# Altium project STM32_base.PrjPcb
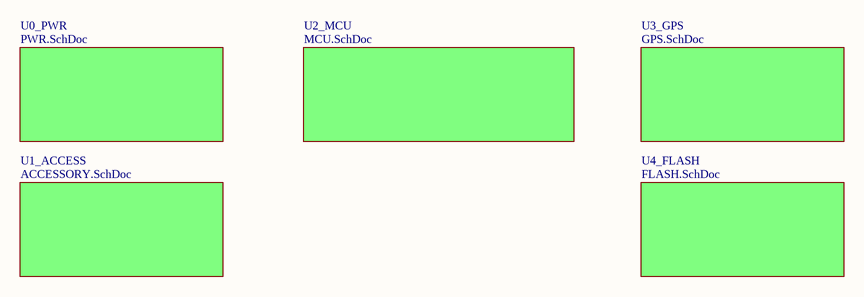
[diagram p0: BLOCK.SchDoc]
6 sheets, 52 parts. Net scope: flat (ports and power ports of the same name join across sheets).
Board file: STM32_base.PcbDoc
Sheets:
  BLOCK.SchDoc
    U2_MCU = MCU.SchDoc
    U0_PWR = PWR.SchDoc
    U3_GPS = GPS.SchDoc
    U1_ACCESS = ACCESSORY.SchDoc
    U4_FLASH = FLASH.SchDoc

## Sheet BLOCK.SchDoc
size A4; Organization: Altium Limited; Address1: L3, 12a Rodborough Rd; Address2: Frenchs Forest; Address3: NSW; Address4: Australia 2086

### Sub-sheets
U0_PWR = PWR.SchDoc: no entries
U1_ACCESS = ACCESSORY.SchDoc: no entries
U2_MCU = MCU.SchDoc: no entries
U3_GPS = GPS.SchDoc: no entries
U4_FLASH = FLASH.SchDoc: no entries

### Notes on the sheet
- Title
- Size:
- Date:
- A4
- Number:
- Time:
- Revision:
- Sheet
- of
- File:

## Sheet MCU.SchDoc
size A4; Organization: Altium Limited; Address1: L3, 12a Rodborough Rd; Address2: Frenchs Forest; Address3: NSW; Address4: Australia 2086
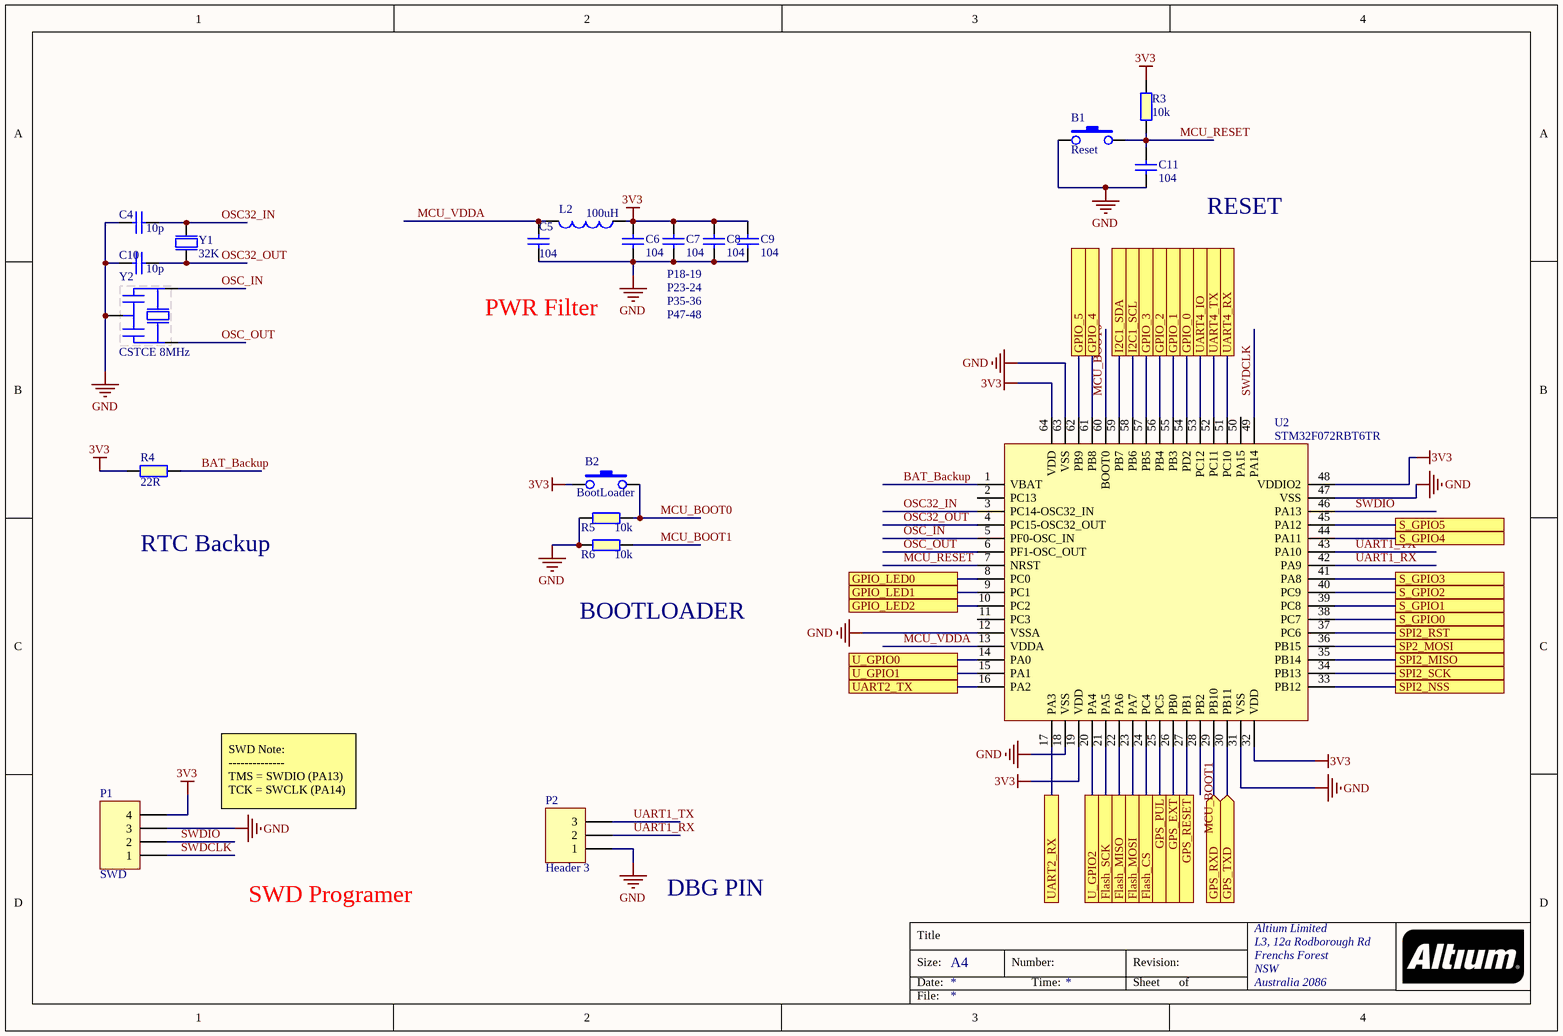
[diagram p1: MCU.SchDoc]

### Parts
B1  Reset  [TACTILE-SWITCH-1101NE]
B2  BootLoader  [TACTILE-SWITCH-1101NE]
C4  10p  [C_0603]
C5  104  [C_0603]
C6  104  [C_0603]
C7  104  [C_0603]
C8  104  [C_0603]
C9  104  [C_0603]
C10  10p  [C_0603]
C11  104  [C_0603]
L2  100uH  [INDUCTOR_0603]
P1  SWD  [HDR1X4]
P2  Header 3  [HDR1X3]
R3  10k  [R_0603]
R4  22R  [R_0603]
R5  10k  [R_0603]
R6  10k  [R_0603]
U2  STM32F072RBT6TR  [STM32L072RBT]
Y1  value 32K  [Crystal_2P]  (hidden comment: Crystal_2P)
Y2  CSTCE 8MHz  [Crystal_4P]

### Ports
Flash_CS, Flash_MISO, Flash_MOSI, Flash_SCK, GPIO_0, GPIO_1, GPIO_2, GPIO_3, GPIO_4, GPIO_5, GPIO_LED0, GPIO_LED1, GPIO_LED2, GPS_EXT, GPS_PUL, GPS_RESET, GPS_RXD (in), GPS_TXD (in), I2C1_SCL, I2C1_SDA, S_GPIO0, S_GPIO1, S_GPIO2, S_GPIO3, S_GPIO4, S_GPIO5, SP2_MOSI, SPI2_MISO, SPI2_NSS, SPI2_RST, SPI2_SCK, U_GPIO0, U_GPIO1, U_GPIO2, UART2_RX, UART2_TX, UART4_IO, UART4_RX, UART4_TX

### Nets
3V3: B2.1 C6.2 C7.2 C8.2 C9.2 L2.1 P1.4 R3.1 R4.1 U2.19(VDD) U2.32(VDD) U2.48(VDDIO2) U2.64(VDD)
GND: B1.1 C4.1 C5.1 C6.1 C7.1 C8.1 C9.1 C10.1 C11.2 P1.3 P2.1 R5.1 R6.1 U2.12(VSSA) U2.18(VSS) U2.31(VSS) U2.47(VSS) U2.63(VSS) Y2.2
BAT_Backup: R4.2 U2.1(VBAT)
MCU_BOOT0: B2.2 R5.2 U2.60(BOOT0)
MCU_BOOT1: R6.2 U2.28(PB2)
MCU_RESET: B1.2 C11.1 R3.2 U2.7(NRST)
MCU_VDDA: C5.2 L2.2 U2.13(VDDA)
OSC32_IN: C4.2 U2.3(PC14-OSC32_IN) Y1.2
OSC32_OUT: C10.2 U2.4(PC15-OSC32_OUT) Y1.1
OSC_IN: U2.5(PF0-OSC_IN) Y2.1
OSC_OUT: U2.6(PF1-OSC_OUT) Y2.3
SWDCLK: P1.1 U2.49(PA14)
SWDIO: P1.2 U2.46(PA13)
UART1_RX: P2.2 U2.42(PA9)
UART1_TX: P2.3 U2.43(PA10)
NetC15_1: U2.53(PC12) ; port UART4_IO
NetC15_2: U2.52(PC11) ; port UART4_TX
NetC15_3: U2.51(PC10) ; port UART4_RX
NetC16_3: U2.59(PB7) ; port I2C1_SDA
NetC16_4: U2.9(PC1) ; port GPIO_LED1
NetC16_5: U2.44(PA11) ; port S_GPIO4
NetC16_6: U2.40(PC9) ; port S_GPIO2
NetC16_7: U2.38(PC7) ; port S_GPIO0
NetC16_8: U2.36(PB15) ; port SP2_MOSI
NetC16_9: U2.34(PB13) ; port SPI2_SCK
NetC16_10: U2.14(PA0) ; port U_GPIO0
NetC16_11: U2.16(PA2) ; port UART2_TX
NetC16_12: U2.20(PA4) ; port U_GPIO2
NetC16_13: U2.17(PA3) ; port UART2_RX
NetC16_14: U2.15(PA1) ; port U_GPIO1
NetC16_15: U2.33(PB12) ; port SPI2_NSS
NetC16_16: U2.35(PB14) ; port SPI2_MISO
NetC16_17: U2.37(PC6) ; port SPI2_RST
NetC16_18: U2.39(PC8) ; port S_GPIO1
NetC16_19: U2.41(PA8) ; port S_GPIO3
NetC16_20: U2.45(PA12) ; port S_GPIO5
NetC16_21: U2.10(PC2) ; port GPIO_LED2
NetC16_22: U2.8(PC0) ; port GPIO_LED0
NetC16_23: U2.58(PB6) ; port I2C1_SCL
NetC19_3: U2.54(PD2) ; port GPIO_0
NetC19_4: U2.55(PB3) ; port GPIO_1
NetC19_5: U2.56(PB4) ; port GPIO_2
NetC19_6: U2.57(PB5) ; port GPIO_3
NetC19_7: U2.61(PB8) ; port GPIO_4
NetC19_8: U2.62(PB9) ; port GPIO_5
NetR2_2: U2.27(PB1) ; port GPS_RESET
NetR10_1: U2.24(PC4) ; port Flash_CS
NetU1_2: U2.29(PB10) ; port GPS_RXD
NetU1_3: U2.30(PB11) ; port GPS_TXD
NetU2_21: U2.21(PA5) ; port Flash_SCK
NetU2_22: U2.22(PA6) ; port Flash_MISO
NetU2_23: U2.23(PA7) ; port Flash_MOSI
NetU2_25: U2.25(PC5) ; port GPS_PUL
NetU2_26: U2.26(PB0) ; port GPS_EXT

Not connected (* = marked no-connect by the designer): U2 2(PC13) 11(PC3) 50(PA15)

### Notes on the sheet
- RESET
- P23-24
- P35-36
- P18-19
- PWR Filter
- P47-48
- RTC Backup
- BOOTLOADER
- SWD Note:
  --------------
  TMS = SWDIO (PA13)
  TCK = SWCLK (PA14)
- SWD Programer
- DBG PIN
- Title
- Size:
- Date:
- A4
- Number:
- Time:
- Revision:
- Sheet
- of
- File:

### Library data of the parts
B1 B2 = Button_2P_SMD
C4-C11 = Cap SMD 0805: Capacitor SMD; Published: 8-Jun-2000; LatestRevisionDate: 17-Jul-2002; LatestRevisionNote: Re-released for DXP Platform.; PackageReference: RAD-0.3; Publisher: Altium Limited
  C4 C10: Value: 10p
  C5-C9 C11: Value: 104
L2 = INDUCTOR_0805
P1 = Header 4: Header, 4-Pin; LatestRevisionDate: 17-Jul-2002; LatestRevisionNote: Re-released for DXP Platform.; Publisher: Altium Limited
P2 = Header 3: Header, 3-Pin; LatestRevisionDate: 17-Jul-2002; LatestRevisionNote: Re-released for DXP Platform.; Publisher: Altium Limited
R3-R6 = RESISTOR_0805
  R3 R5 R6: Value: 10k
  R4: Value: 22R
U2 = STM32F072RBT6TR: IC MCU 32BIT 128KB FLASH 64LQFP; Manufacturer: STMicroelectronics; Min Supply Voltage: 2V; Max Supply Voltage: 3.6V; RAM Size: 16KB; Number of I/Os: 51; Frequency: 48MHz; Max Power Dissipation: 455mW; Interface: I2C,SPI,USB,CAN,HDMI,IrDA,UART,USART,LIN,I2S; Number of Timers/Counters: 9; Oscillator Type: Internal; Data Bus Width: 32b; Watchdog Timer: Yes; Number of ADC Channels: 19; Peripherals: POR,PWM,WDT,DMA; Core Architecture: ARM; Manufacturer Part Number: STM32F072RBT6; Stock 1: 9149; Pricing 1: 1=3.93, 10=3.532, 160=2.89381, 640=2.46344, 1120=2.0776 (USD); Mount: Surface Mount; Case/Package: LQFP; Number of Pins: 64; Weight: 0.012088oz; Min Operating Temperature: -40°C; Max Operating Temperature: 85°C; Memory Size: 128KB; Packaging: Tray; Number of Programmable I/O: 51; Max Frequency: 48MHz; Memory Type: FLASH; Package Quantity: 960; REACH SVHC: No SVHC; Lead Free: Lead Free; ComponentLink1URL: http://www.st.com/web/en/resource/technical/document/datasheet/DM00090510.pdf?src-supplier=Avnet; ComponentLink1Description: http://www.st.com/web/en/resource/technical/document/datasheet/DM00090510.pdf?src-supplier=Avnet; Supplier 1: Digi-Key; Supplier Part Number 1: 497-14644-ND
Y2 = Crystal_CSTCE: (T) Crystal MHz with Capacitance Built-in

## Sheet PWR.SchDoc
size A; Organization: Altium Limited; Address1: L3, 12a Rodborough Rd; Address2: Frenchs Forest; Address3: NSW; Address4: Australia 2086
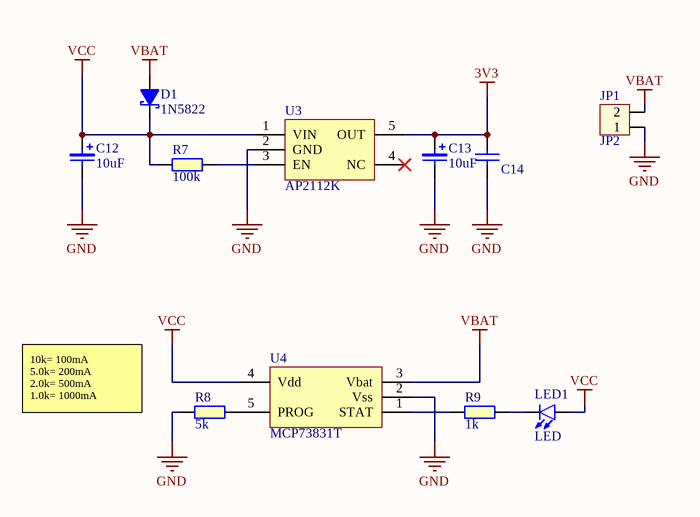
[diagram p2: PWR.SchDoc]

### Parts
C12  10uF  [CASE A]
C13  10uF  [CASE A]
C14  0.01uF  [C_0603]  (value not drawn)
D1  1N5822  [DO-214AC]
JP1  JP2  [CON2]
LED1  LED  [LED_0603]
R7  100k  [R_0603]
R8  5k  [R_0603]
R9  1k  [R_0603]
U3  AP2112K  [SOT25]
U4  MCP73831T  [SOT23-5]

### Nets
3V3: C13.A C14.2 U3.5(OUT)
GND: C12.K C13.K C14.1 JP1.1 R8.2 U3.2(GND) U4.2(Vss)
VBAT: D1.A JP1.2 U4.3(Vbat)
VCC: C12.A D1.K LED1.A R7.2 U3.1(VIN) U4.4(Vdd)
NetLED1_K: LED1.K R9.1
NetR7_1: R7.1 U3.3(EN)
NetR8_1: R8.1 U4.5(PROG)
NetR9_2: R9.2 U4.1(STAT)

Not connected (* = marked no-connect by the designer): U3 4(NC)*

### Notes on the sheet
- (near R8) 10k= 100mA
  5.0k= 200mA
  2.0k= 500mA
  1.0k= 1000mA
- Title
- Size:
- Date:
- A
- Number:
- Time:
- Revision:
- Sheet
- of
- File:

### Library data of the parts
C12 C13 = Capacitor-Tantalium: CAP TANT 10UF 16V 10% 2917; Part Number: T491A106K010AT; Part Description: CAP TANT 10UF 10V 10% 1206; Manufacturer: KEMET; ID: 3; Voltage: 10VDC; Tolerance: 20%; Component Kind: Standard; Component Type: Standard; Pin Count: 2; Status: Not Recommended; Manufacturer Part Number: T491A106K010AT; Case: A CASE; Mounted: Yes; Socket: No; SMD: Yes; ComponentHeigh: https://www.mouser.vn; Manufacturer1 Example: MDBK; Value: 10uF
C14 = CAP_0603
D1 = DIODE_1N5822: 3A 40V SS34
JP1 = Con2: Connector 2; Value: Connector 2
LED1 = LED_0603
R7-R9 = RES_0603
U3 = AP2112K: IC REG LINEAR 3.3V 600MA SOT25; Manufacturer: Diodes; Manufacturer Part Number: AP2112K-3.3TRG1; Min Input Voltage: 2.5V; Number of Outputs: 1; Dropout Voltage: 250mV; Max Input Voltage: 6V; Quiescent Current: 55uA; Polarity: Positive; Accuracy: 1.5%; Output Type: Fixed; Supplier 1: Mouser; Stock 1: 34833; Pricing 1: 1=0.47, 10=0.327, 50=0.327, 100=0.15, 1000=0.116, 10000=0.09 (USD); Mount: Surface Mount; Case/Package: SOT-23-5; Number of Pins: 5; Min Operating Temperature: -40°C; Max Operating Temperature: 85°C; Package Quantity: 1; Packaging: Tape and Reel; Output Voltage: 3.3V; Output Current: 600mA; Number of Regulators: 1; Max Output Current: 600mA; Length: 3.1mm; Height: 1.3mm; Width: 1.7mm; Lead Free: Lead Free; ComponentLink1URL: http://www.diodes.com/datasheets/AP2112.pdf?src-supplier=Avnet; ComponentLink1Description: http://www.diodes.com/datasheets/AP2112.pdf?src-supplier=Avnet; ComponentLink2URL: https://www.diodes.com/assets/Datasheets/AP2112.pdf?src-supplier=Digi-Key; ComponentLink2Description: https://www.diodes.com/assets/Datasheets/AP2112.pdf?src-supplier=Digi-Key; Supplier Part Number 1: 621-AP2112K-3.3TRG1
U4 = MCP73831T: IC CONTROLLR LI-ION 4.2V SOT23-5; Manufacturer: Microchip; Manufacturer Part Number: MCP73831T-2ACI/OT; Number of Cells: 1; Max Supply Voltage: 6V; Min Supply Voltage: 3.75V; Output Current: 500mA; Max Output Voltage: 4.5V; Min Output Voltage: 4.168V; Max Power Dissipation: 1.54W; Drain to Source Resistance: 350mR; Voltage Rating: 4.534V; Supplier 1: Digi-Key; Stock 1: 50323; Pricing 1: 1=0.58, 25=0.484, 100=0.4326 (USD); Mount: Surface Mount; Case/Package: SOT-23; Number of Pins: 5; Weight: 0.00709oz; Contact Plating: Tin,Matte; Min Operating Temperature: -40°C; Max Operating Temperature: 85°C; Output Voltage: 4.2V; Packaging: Tape and Reel; Max Charge Current: 500mA; Max Input Voltage: 6V; Number of Outputs: 1; Number of Channels: 1; Termination: SMD/SMT; Length: 0.122inch; Height: 0.051inch; Width: 0.071inch; Radiation Hardening: No; REACH SVHC: No SVHC; Lead Free: Lead Free; ComponentLink1URL: http://www.microchip.com/mymicrochip/filehandler.aspx?ddocname=en023833&src-supplier=Digi-Key; ComponentLink1Description: http://www.microchip.com/mymicrochip/filehandler.aspx?ddocname=en023833&src-supplier=Digi-Key; ComponentLink2URL: http://www.farnell.com/datasheets/630369.pdf?src-supplier=Element14; ComponentLink2Description: http://www.farnell.com/datasheets/630369.pdf?src-supplier=Element14; ComponentLink3URL: http://www.farnell.com/datasheets/2124927.pdf?src-supplier=Element14; ComponentLink3Description: http://www.farnell.com/datasheets/2124927.pdf?src-supplier=Element14; ComponentLink4URL: http://ww1.microchip.com/downloads/en/DeviceDoc/21984e.pdf?src-supplier=Avnet; ComponentLink4Description: http://ww1.microchip.com/downloads/en/DeviceDoc/21984e.pdf?src-supplier=Avnet; ComponentLink5URL: http://www.farnell.com/datasheets/2124927.pdf?src-supplier=Newark; ComponentLink5Description: http://www.farnell.com/datasheets/2124927.pdf?src-supplier=Newark; ComponentLink6URL: http://www.microchip.com/mymicrochip/filehandler.aspx?ddocname=en025112&src-supplier=Future+Electronics; ComponentLink6Description: http://www.microchip.com/mymicrochip/filehandler.aspx?ddocname=en025112&src-supplier=Future+Electronics; ComponentLink7URL: http://www.produktinfo.conrad.com/datenblaetter/650000-674999/651521-da-01-en-CONTR__MCP73831T_2ACI_OT_SOT_23_5_MCP.pdf?src-supplier=Conrad; ComponentLink7Description: http://www.produktinfo.conrad.com/datenblaetter/650000-674999/651521-da-01-en-CONTR__MCP73831T_2ACI_OT_SOT_23_5_MCP.pdf?src-supplier=Conrad; Supplier Part Number 1: MCP73831T-2ACI/OTDKR-ND

## Sheet GPS.SchDoc
size A; Organization: Altium Limited; Address1: L3, 12a Rodborough Rd; Address2: Frenchs Forest; Address3: NSW; Address4: Australia 2086
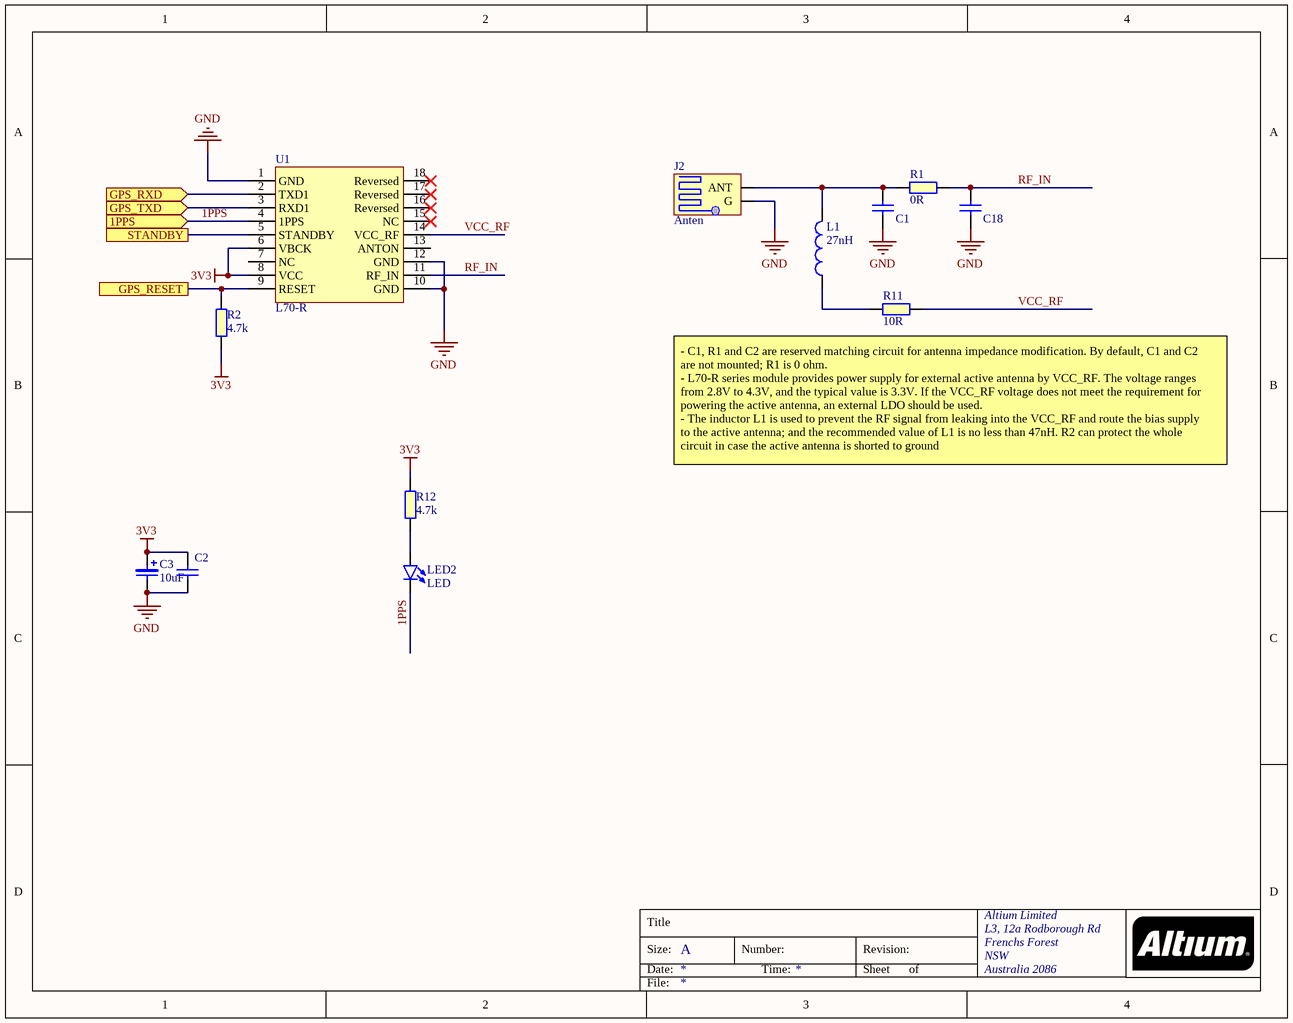
[diagram p3: GPS.SchDoc]

### Parts
C1  DNP  [C_0603]  (value not drawn)
C2  0.01uF  [C_0603]  (value not drawn)
C3  10uF  [CASE A]
C18  DNP  [C_0603]  (value not drawn)
J2  Anten  [ANTEN_IPEX]
L1  27nH  [INDUCTOR_0603]
LED2  LED  [LED_0603]
R1  0R  [R_0603]
R2  4.7k  [R_0603]
R11  10R  [R_0603]
R12  4.7k  [R_0603]
U1  L70-R  [MODULE_MAX-7Q]

### Ports
1PPS (in), GPS_RESET, GPS_RXD (in), GPS_TXD (in), STANDBY

### Nets
3V3: C2.2 C3.A R2.1 R12.2 U1.6(VBCK) U1.8(VCC)
GND: C1.2 C2.1 C3.K C18.2 J2.2(G) U1.1(GND) U1.10(GND) U1.12(GND)
1PPS: LED2.K U1.4(1PPS) ; port 1PPS
RF_IN: C18.1 R1.1 U1.11(RF_IN)
VCC_RF: R11.1 U1.14(VCC_RF)
NetC1_1: C1.1 J2.1(ANT) L1.2 R1.2
NetL1_1: L1.1 R11.2
NetLED2_A: LED2.A R12.1
NetR2_2: R2.2 U1.9(RESET) ; port GPS_RESET
NetU1_2: U1.2(TXD1) ; port GPS_RXD
NetU1_3: U1.3(RXD1) ; port GPS_TXD
NetU1_5: U1.5(STANDBY) ; port STANDBY

Not connected (* = marked no-connect by the designer): U1 7(NC) 13(ANTON) 15(NC)* 16(Reversed)* 17(Reversed)* 18(Reversed)*

### Notes on the sheet
- (near R11) - C1, R1 and C2 are reserved matching circuit for antenna impedance modification. By default, C1 and C2
  are not mounted; R1 is 0 ohm.
  - L70-R series module provides power supply for external active antenna by VCC_RF. The voltage ranges
  from 2.8V to 4.3V, and the typical value is 3.3V. If the VCC_RF voltage does not meet the requirement for
  powering the active antenna, an external LDO should be used.
  - The inductor L1 is used to prevent the RF signal from leaking into the VCC_RF and route the bias supply
  to the active antenna; and the recommended value of L1 is no less than 47nH. R2 can protect the whole
  circuit in case the active antenna is shorted to ground
- Title
- Size:
- Date:
- A
- Number:
- Time:
- Revision:
- Sheet
- of
- File:

### Library data of the parts
C1 C2 C18 = CAP_0603
C3 = Capacitor-Tantalium: as C12 on sheet PWR; Component Kind: Standard; Component Type: Standard; Pin Count: 2; Status: Not Recommended; Manufacturer Part Number: T491A106K010AT; Case: A CASE; Mounted: Yes; Socket: No; SMD: Yes; ComponentHeigh: https://www.mouser.vn; Manufacturer1 Example: MDBK; Value: 10uF
J2 = ANTEN_IPEX: CONN UMC RCPT STR 50 OHM SMD; Manufacturer: Taoglas; Manufacturer Part Number: RECE.20279.001E.01; Connector Type: Coaxial,Male Pin; Body Material: Brass; Body Plating: Gold; Gender: Male; Supplier 1: Digi-Key; Stock 1: 45630; Pricing 1: 1=0.75 (USD); Packaging: Tape and Reel; Fastening Type: Snap; Housing Color: White; Supplier Part Number 1: 931-1107-6-ND; Mount: Surface Mount; Case/Package: SMD/SMT; Contact Material: Brass; Contact Plating: Gold; Package Quantity: 1; Termination: Solder; Orientation: Straight
L1 = INDUCTOR_0603
LED2 = LED_0603
R1 R2 R11 R12 = RES_0603
U1 = L70-R: GPS Receiver 1575.42MHz 2.5V/3.3V 18-Pin; Manufacturer: Quectel Wireless Solutions; Manufacturer Part Number: L70R; Max Frequency: 1.57542GHz; Supplier 1: Avnet; Stock 1: 0; RoHS: Yes; Min Operating Temperature: -40°C; Max Operating Temperature: 85°C; Packaging: Tape and Reel; Radiation Hardening: No; ComponentLink1URL: https://datasheet.ciiva.com/48437/quectel-l70-r-gps-specification-v1-0-48437770.pdf?src-supplier=Avnet; ComponentLink1Description: https://datasheet.ciiva.com/48437/quectel-l70-r-gps-specification-v1-0-48437770.pdf?src-supplier=Avnet; Supplier Part Number 1: L70R-M37

## Sheet ACCESSORY.SchDoc
size A; Organization: Altium Limited; Address1: L3, 12a Rodborough Rd; Address2: Frenchs Forest; Address3: NSW; Address4: Australia 2086
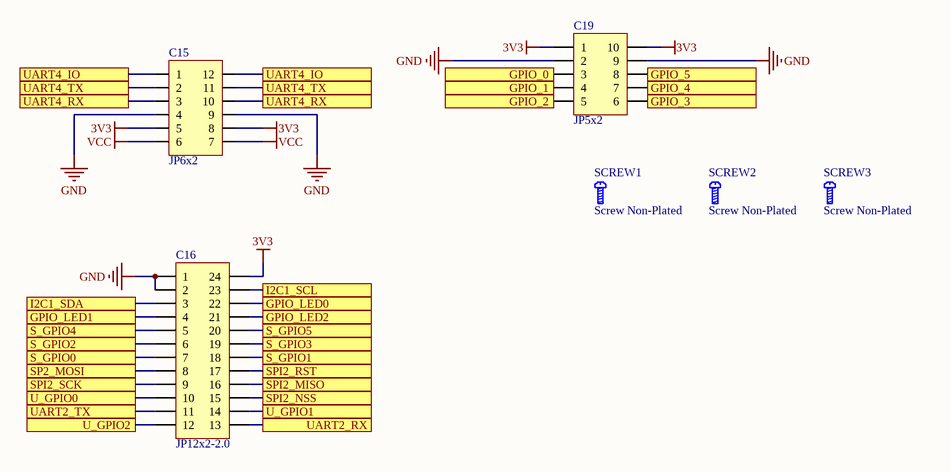
[diagram p4: ACCESSORY.SchDoc]

### Parts
C15  JP6x2  [JP6-D2T]
C16  JP12x2-2.0  [J12-D2T]
C19  JP5x2  [JP5-D2T]
SCREW1  Screw Non-Plated  [SCREW_NON-PLATED_2MM]
SCREW2  Screw Non-Plated  [SCREW_NON-PLATED_2MM]
SCREW3  Screw Non-Plated  [SCREW_NON-PLATED_2MM]

### Ports
GPIO_0, GPIO_1, GPIO_2, GPIO_3, GPIO_4, GPIO_5, GPIO_LED0, GPIO_LED1, GPIO_LED2, I2C1_SCL, I2C1_SDA, S_GPIO0, S_GPIO1, S_GPIO2, S_GPIO3, S_GPIO4, S_GPIO5, SP2_MOSI, SPI2_MISO, SPI2_NSS, SPI2_RST, SPI2_SCK, U_GPIO0, U_GPIO1, U_GPIO2, UART2_RX, UART2_TX, UART4_IO, UART4_RX, UART4_TX

### Nets
3V3: C15.5 C15.8 C16.24 C19.1 C19.10
GND: C15.4 C15.9 C16.1 C16.2 C19.2 C19.9
VCC: C15.6 C15.7
NetC15_1: C15.1 C15.12 ; port UART4_IO
NetC15_2: C15.2 C15.11 ; port UART4_TX
NetC15_3: C15.3 C15.10 ; port UART4_RX
NetC16_3: C16.3 ; port I2C1_SDA
NetC16_4: C16.4 ; port GPIO_LED1
NetC16_5: C16.5 ; port S_GPIO4
NetC16_6: C16.6 ; port S_GPIO2
NetC16_7: C16.7 ; port S_GPIO0
NetC16_8: C16.8 ; port SP2_MOSI
NetC16_9: C16.9 ; port SPI2_SCK
NetC16_10: C16.10 ; port U_GPIO0
NetC16_11: C16.11 ; port UART2_TX
NetC16_12: C16.12 ; port U_GPIO2
NetC16_13: C16.13 ; port UART2_RX
NetC16_14: C16.14 ; port U_GPIO1
NetC16_15: C16.15 ; port SPI2_NSS
NetC16_16: C16.16 ; port SPI2_MISO
NetC16_17: C16.17 ; port SPI2_RST
NetC16_18: C16.18 ; port S_GPIO1
NetC16_19: C16.19 ; port S_GPIO3
NetC16_20: C16.20 ; port S_GPIO5
NetC16_21: C16.21 ; port GPIO_LED2
NetC16_22: C16.22 ; port GPIO_LED0
NetC16_23: C16.23 ; port I2C1_SCL
NetC19_3: C19.3 ; port GPIO_0
NetC19_4: C19.4 ; port GPIO_1
NetC19_5: C19.5 ; port GPIO_2
NetC19_6: C19.6 ; port GPIO_3
NetC19_7: C19.7 ; port GPIO_4
NetC19_8: C19.8 ; port GPIO_5

### Notes on the sheet
- Title
- Size:
- Date:
- A
- Number:
- Time:
- Revision:
- Sheet
- of
- File:

### Library data of the parts
C15 = JP6x2: WR-PHD 2.54 mm Dual Socket Header; Manufacturer: W¨¹rth Elektronik eiSos GmbH; partNo: 61301221821; ComponentLink1 Description: Manufacturer; ComponentLink2 Description: Datasheet; NoPins: 12; Created Date: 29 March 2013; ComponentLink1URL: http://www.we-online.com; ComponentLink2URL: http://katalog.we-online.de/em/datasheet/6130xx21821.pdf; Created by: Karrer Zheng
C16 = JP12x2-2.0: WR-PHD 2.00 mm Dual Pin Header; Manufacturer: W¨¹rth Elektronik eiSos GmbH; partNo: 62002421121; ComponentLink1 Description: Manufacturer; ComponentLink2 Description: Datasheet; NoPins: 24; System: Connector; Created Date: 2 April 2013; ComponentLink1URL: http://www.we-online.com; ComponentLink2URL: http://katalog.we-online.de/em/datasheet/6200xx21121.pdf; Created by: Karrer Zheng
C19 = JP5x2: WR-PHD 2.54 mm Dual Socket Header; Manufacturer: W¨¹rth Elektronik eiSos GmbH; partNo: 61301021821; ComponentLink1 Description: Manufacturer; ComponentLink2 Description: Datasheet; NoPins: 10; Created Date: 29 March 2013; ComponentLink1URL: http://www.we-online.com; ComponentLink2URL: http://katalog.we-online.de/em/datasheet/6130xx21821.pdf; Created by: Karrer Zheng
SCREW1-SCREW3 = SCREW_NON-PLATED

## Sheet FLASH.SchDoc
size A; Organization: Altium Limited; Address1: L3, 12a Rodborough Rd; Address2: Frenchs Forest; Address3: NSW; Address4: Australia 2086
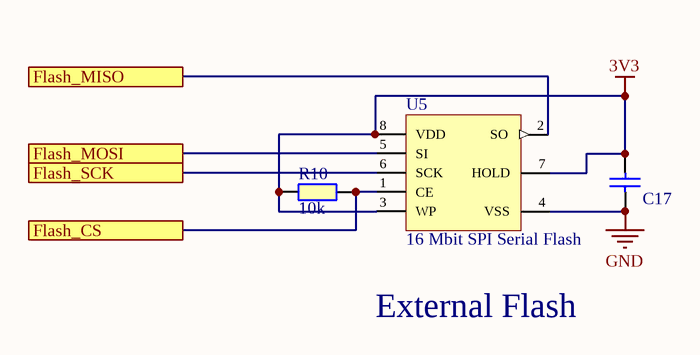
[diagram p5: FLASH.SchDoc]

### Parts
C17  0.01uF  [C_0603]  (value not drawn)
R10  10k  [R_0603]
U5  16 Mbit SPI Serial Flash  [SOIC127P790X216-8N]

### Ports
Flash_CS, Flash_MISO, Flash_MOSI, Flash_SCK

### Nets
3V3: C17.2 R10.2 U5.3(WP) U5.7(HOLD) U5.8(VDD)
GND: C17.1 U5.4(VSS)
NetR10_1: R10.1 U5.1(CE) ; port Flash_CS
NetU2_21: U5.6(SCK) ; port Flash_SCK
NetU2_22: U5.2(SO) ; port Flash_MISO
NetU2_23: U5.5(SI) ; port Flash_MOSI

### Notes on the sheet
- External Flash
- Title
- Size:
- Date:
- A
- Number:
- Time:
- Revision:
- Sheet
- of
- File:

### Library data of the parts
C17 = CAP_0603
R10 = RES_0603
U5 = SST25VF016B: MPN: SST25VF016B-50-4I-S2AF; OC_FARNELL: 1368695; OC_NEWARK: 82R4471; PACKAGE: SOIC-8; SUPPLIER: SILICON STORAGE TECHNOLOGY

## Nets that join several sheets
3V3: MCU (13 pins), PWR (C13.A C14.2 U3.5), GPS (6 pins), ACCESSORY (5 pins), FLASH (5 pins)
GND: MCU (19 pins), PWR (7 pins), GPS (8 pins), ACCESSORY (6 pins), FLASH (C17.1 U5.4)
VCC: PWR (6 pins), ACCESSORY (C15.6 C15.7)
NetC15_1: MCU (U2.53), ACCESSORY (C15.1 C15.12)
NetC15_2: MCU (U2.52), ACCESSORY (C15.2 C15.11)
NetC15_3: MCU (U2.51), ACCESSORY (C15.3 C15.10)
NetC16_3: MCU (U2.59), ACCESSORY (C16.3)
NetC16_4: MCU (U2.9), ACCESSORY (C16.4)
NetC16_5: MCU (U2.44), ACCESSORY (C16.5)
NetC16_6: MCU (U2.40), ACCESSORY (C16.6)
NetC16_7: MCU (U2.38), ACCESSORY (C16.7)
NetC16_8: MCU (U2.36), ACCESSORY (C16.8)
NetC16_9: MCU (U2.34), ACCESSORY (C16.9)
NetC16_10: MCU (U2.14), ACCESSORY (C16.10)
NetC16_11: MCU (U2.16), ACCESSORY (C16.11)
NetC16_12: MCU (U2.20), ACCESSORY (C16.12)
NetC16_13: MCU (U2.17), ACCESSORY (C16.13)
NetC16_14: MCU (U2.15), ACCESSORY (C16.14)
NetC16_15: MCU (U2.33), ACCESSORY (C16.15)
NetC16_16: MCU (U2.35), ACCESSORY (C16.16)
NetC16_17: MCU (U2.37), ACCESSORY (C16.17)
NetC16_18: MCU (U2.39), ACCESSORY (C16.18)
NetC16_19: MCU (U2.41), ACCESSORY (C16.19)
NetC16_20: MCU (U2.45), ACCESSORY (C16.20)
NetC16_21: MCU (U2.10), ACCESSORY (C16.21)
NetC16_22: MCU (U2.8), ACCESSORY (C16.22)
NetC16_23: MCU (U2.58), ACCESSORY (C16.23)
NetC19_3: MCU (U2.54), ACCESSORY (C19.3)
NetC19_4: MCU (U2.55), ACCESSORY (C19.4)
NetC19_5: MCU (U2.56), ACCESSORY (C19.5)
NetC19_6: MCU (U2.57), ACCESSORY (C19.6)
NetC19_7: MCU (U2.61), ACCESSORY (C19.7)
NetC19_8: MCU (U2.62), ACCESSORY (C19.8)
NetR2_2: MCU (U2.27), GPS (R2.2 U1.9)
NetR10_1: MCU (U2.24), FLASH (R10.1 U5.1)
NetU1_2: MCU (U2.29), GPS (U1.2)
NetU1_3: MCU (U2.30), GPS (U1.3)
NetU2_21: MCU (U2.21), FLASH (U5.6)
NetU2_22: MCU (U2.22), FLASH (U5.2)
NetU2_23: MCU (U2.23), FLASH (U5.5)